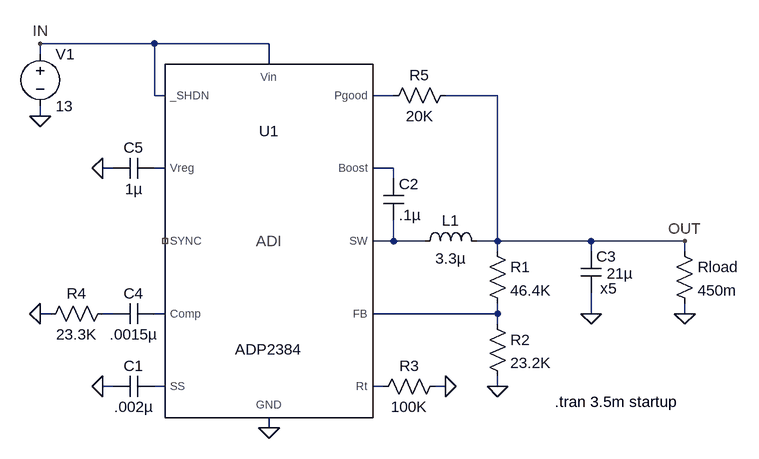
[diagram p0: schematic ADP2384.asc]
ADP2384.asc, the LTspice schematic file:
Version 4
SHEET 1 1000 680
WIRE 48 -128 -128 -128
WIRE 224 -128 48 -128
WIRE -128 -112 -128 -128
WIRE 224 -96 224 -128
WIRE 48 -48 48 -128
WIRE 64 -48 48 -48
WIRE 416 -48 384 -48
WIRE 576 -48 496 -48
WIRE -128 -16 -128 -32
WIRE -16 64 -32 64
WIRE 64 64 48 64
WIRE 416 64 384 64
WIRE 416 80 416 64
WIRE 416 176 416 144
WIRE 416 176 384 176
WIRE 464 176 416 176
WIRE 576 176 576 -48
WIRE 576 176 544 176
WIRE 720 176 576 176
WIRE 864 176 720 176
WIRE 576 192 576 176
WIRE 720 192 720 176
WIRE 864 192 864 176
WIRE -112 288 -128 288
WIRE -16 288 -32 288
WIRE 64 288 48 288
WIRE 576 288 576 272
WIRE 576 288 384 288
WIRE 720 288 720 256
WIRE 864 288 864 272
WIRE 576 304 576 288
WIRE -16 400 -32 400
WIRE 64 400 48 400
WIRE 400 400 384 400
WIRE 496 400 480 400
WIRE 576 400 576 384
WIRE 224 464 224 448
FLAG -32 400 0
FLAG 224 464 0
FLAG 576 400 0
FLAG 496 400 0
FLAG -128 288 0
FLAG -128 -16 0
FLAG 720 288 0
FLAG 864 288 0
FLAG 864 176 OUT
FLAG -128 -128 IN
FLAG -32 64 0
SYMBOL PowerProducts\\ADP2384 224 176 R0
SYMATTR InstName U1
SYMBOL cap 48 384 R90
WINDOW 0 0 32 VBottom 2
WINDOW 3 32 32 VTop 2
SYMATTR InstName C1
SYMATTR Value .002µ
SYMBOL ind 448 192 R270
WINDOW 0 32 56 VTop 2
WINDOW 3 5 56 VBottom 2
SYMATTR InstName L1
SYMATTR Value 3.3µ
SYMBOL res 560 176 R0
SYMATTR InstName R1
SYMATTR Value 46.4K
SYMBOL res 560 288 R0
SYMATTR InstName R2
SYMATTR Value 23.2K
SYMBOL cap 400 80 R0
SYMATTR InstName C2
SYMATTR Value .1µ
SYMBOL cap 704 192 R0
WINDOW 3 40 34 Left 2
WINDOW 40 30 57 Left 2
SYMATTR Value 21µ
SYMATTR SpiceLine2 x5
SYMATTR InstName C3
SYMBOL res 384 416 R270
WINDOW 0 32 56 VTop 2
WINDOW 3 0 56 VBottom 2
SYMATTR InstName R3
SYMATTR Value 100K
SYMBOL cap 48 272 R90
WINDOW 0 0 32 VBottom 2
WINDOW 3 32 32 VTop 2
SYMATTR InstName C4
SYMATTR Value .0015µ
SYMBOL res -16 272 R90
WINDOW 0 0 56 VBottom 2
WINDOW 3 32 56 VTop 2
SYMATTR InstName R4
SYMATTR Value 23.3K
SYMBOL voltage -128 -128 R0
SYMATTR InstName V1
SYMATTR Value 13
SYMBOL res 848 176 R0
SYMATTR InstName Rload
SYMATTR Value 450m
SYMBOL res 512 -64 R90
WINDOW 0 0 56 VBottom 2
WINDOW 3 32 56 VTop 2
SYMATTR InstName R5
SYMATTR Value 20K
SYMBOL cap 48 48 R90
WINDOW 0 0 32 VBottom 2
WINDOW 3 32 32 VTop 2
SYMATTR InstName C5
SYMATTR Value 1µ
TEXT 664 424 Left 2 !.tran 3.5m startup

The netlist it stands for:
* ADP2384.asc
XU1 N009 IN N004 N006 N007 IN N003 N008 0 NC_01 N001 N002 ADP2384  ; pins Rt Vin SW Comp FB _SHDN Boost SS GND SYNC Pgood Vreg
C1 N008 0 .002µ
L1 N004 OUT 3.3µ
R1 OUT N007 46.4K
R2 N007 0 23.2K
C2 N003 N004 .1µ
C3 OUT 0 21µ x5
R3 N009 0 100K
C4 N006 N005 .0015µ
R4 N005 0 23.3K
V1 IN 0 13
Rload OUT 0 450m
R5 OUT N001 20K
C5 N002 0 1µ
.tran 3.5m startup
.lib ADP2384.sub
.backanno
.end